# EAGLE schematic Fuente (EAGLE 9.6.2)
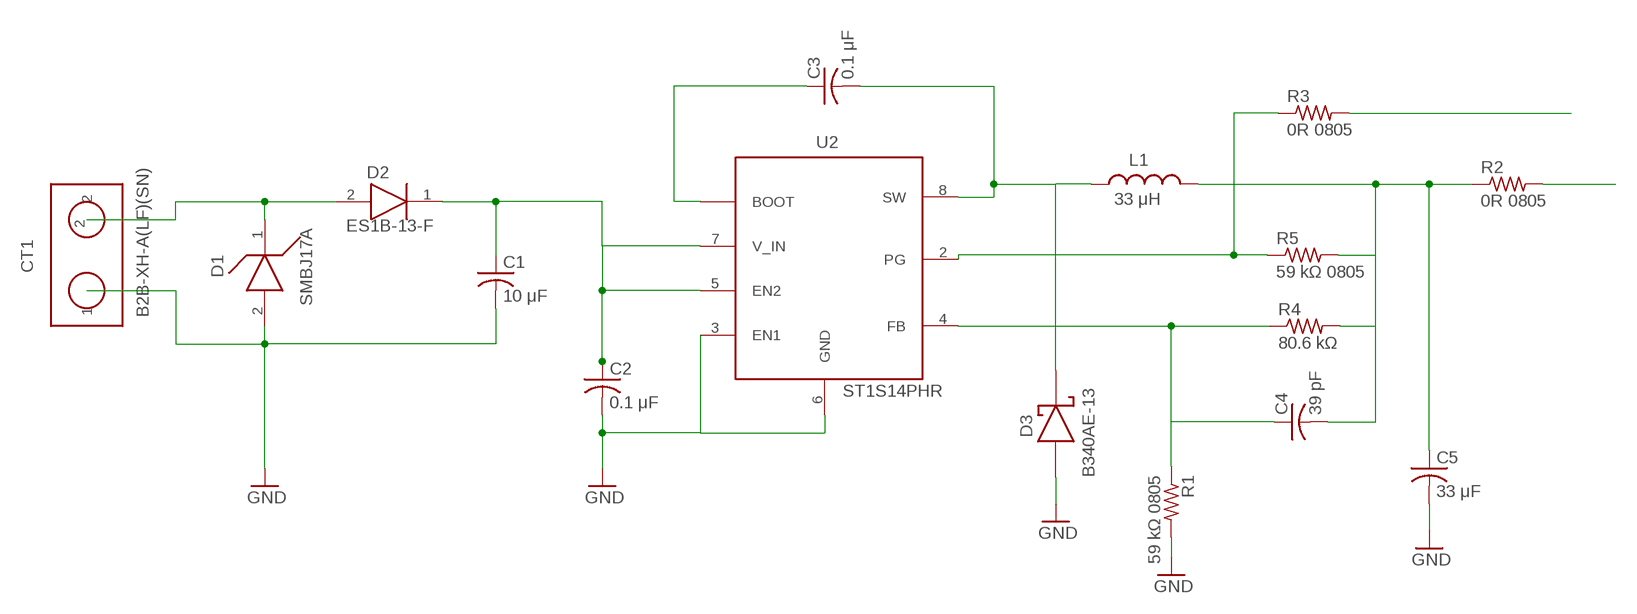
[diagram p0: schematic, sheet 1]

## Parts
C1  10 μF  C-USC0805  [C0805]
C2  0.1 μF  C-USC0805  [C0805]
C3  0.1 μF  C-USC0805  [C0805]
C4  39 pF  C-USC0805  [C0805]
C5  33 μF  C-USC0805  [C0805]
CT1  B2B-XH-A(LF)(SN)  [2-PIN-XH-JST]
D1  SMBJ17A  [DO-214AA]
D2  ES1B-13-F  [DO-214AC]
D3  B340AE-13  B340AE-13-DI  [DO-214AC]
L1  33 μH  LVS606045-330M-N  [SMD]
R1  59 kΩ 0805  R-US_R0805  [R0805]
R2  0R 0805  R-US_R0805  [R0805]
R3  0R 0805  R-US_R0805  [R0805]
R4  80.6 kΩ  R-US_R0805  [R0805]
R5  59 kΩ 0805  R-US_R0805  [R0805]
U2  ST1S14PHR  [8-SOIC]

## Nets
GND: C1.2 C2.2 C5.2 CT1.1 D1.2(A) D3.2(ANODO) R1.2 U2.3(EN1) U2.6(GND)
N$1: C3.1 U2.1(BOOT)
N$2: CT1.2 D1.1(C) D2.2(A)
N$3: C1.1 C2.1 D2.1(C) U2.5(EN2) U2.7(V_IN)
N$4: R3.1 R5.1 U2.2(PG)
N$5: C3.2 D3.1(CATODO) L1.1 U2.8(SW)
N$6: C4.1 R1.1 R4.1 U2.4(FB)
N$7: C4.2 C5.1 L1.2 R2.1 R4.2 R5.2
N$8: R3.2
N$9: R2.2

## Library data of the parts
C1 = rcl:C-US: CAPACITOR, American symbol; PART_NO: GRM21BR61H106KE43L; SPICEPREFIX: C
C2 C3 = rcl:C-US: CAPACITOR, American symbol; PART_NO: GCM21BR72A104KA37L; SPICEPREFIX: C
C4 = rcl:C-US: CAPACITOR, American symbol; PART_NO: GRM21A5C2E390JW01D; SPICEPREFIX: C
C5 = rcl:C-US: CAPACITOR, American symbol; PART_NO: GRM21BR60G336ME15L; SPICEPREFIX: C
CT1 = B2B-XH-A(LF)(SN)-JST:B2B-XH-A(LF)(SN); PART_NO: B2B-XH-A(LF)(SN)
D1 = SMBJ17A:SMBJ17A; PART_NO: SMBJ17A
D2 = nacha_weaitas:ES1B-13-F; PART_NO: ES1B-13-F
D3 = nacha_weaitas:B340AE-13-DI; PART_NO: B340AE-13
L1 = LVS606045-330M-N - CHILISIN ELECTRONICS CORP:LVS606045-330M-N; PART_NO: LVS606045-330M-N
R1 R5 = rcl:R-US_: RESISTOR, American symbol; PART_NO: RC0805FR-0759KL; SPICEPREFIX: R
R2 R3 = rcl:R-US_: RESISTOR, American symbol; SPICEPREFIX: R
R4 = rcl:R-US_: RESISTOR, American symbol; PART_NO: RC0805FR-0780K6L; SPICEPREFIX: R
U2 = nacha_weaitas:ST1S14PHR; PART_NO: ST1S14PHR